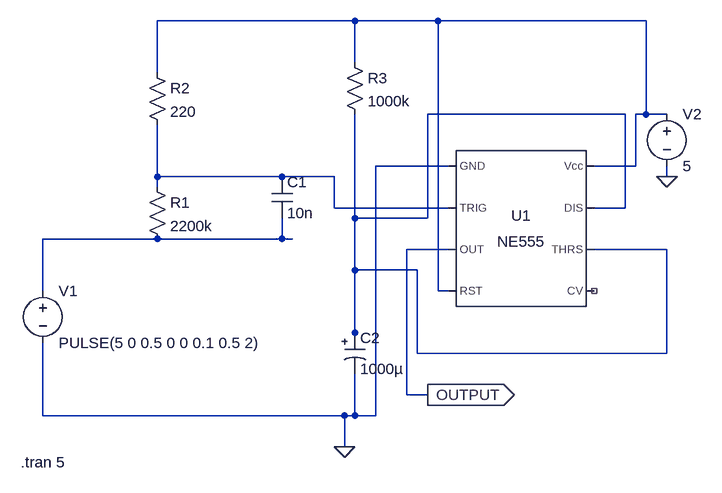
[diagram p0: schematic Erweiterte Ne555 Schaltung.asc]
Erweiterte Ne555 Schaltung.asc, the LTspice schematic file:
Version 4
SHEET 1 888 680
WIRE 352 -144 48 -144
WIRE 480 -144 352 -144
WIRE 800 -144 480 -144
WIRE 352 -80 352 -144
WIRE 48 -64 48 -144
WIRE 768 0 464 0
WIRE 800 0 800 -144
WIRE 800 0 784 0
WIRE 832 0 800 0
WIRE 496 80 384 80
WIRE 784 80 784 0
WIRE 784 80 720 80
WIRE 48 96 48 16
WIRE 240 96 48 96
WIRE 320 96 240 96
WIRE 832 96 832 80
WIRE 48 112 48 96
WIRE 320 144 320 96
WIRE 496 144 320 144
WIRE 768 144 768 0
WIRE 768 144 720 144
WIRE 352 160 352 0
WIRE 464 160 464 0
WIRE 464 160 352 160
WIRE 48 192 -128 192
WIRE 240 192 240 160
WIRE 240 192 48 192
WIRE 256 192 240 192
WIRE 496 208 432 208
WIRE 832 208 720 208
WIRE 352 240 352 160
WIRE 448 240 352 240
WIRE -128 272 -128 192
WIRE 480 272 480 -144
WIRE 496 272 480 272
WIRE 352 336 352 240
WIRE 352 352 352 336
WIRE 448 368 448 240
WIRE 832 368 832 208
WIRE 832 368 448 368
WIRE 432 432 432 208
WIRE 464 432 432 432
WIRE -128 464 -128 352
WIRE 336 464 -128 464
WIRE 352 464 352 400
WIRE 352 464 336 464
WIRE 384 464 384 80
WIRE 384 464 352 464
WIRE 336 512 336 464
FLAG 464 432 OUTPUT
IOPIN 464 432 Out
FLAG 832 96 0
FLAG 336 512 0
SYMBOL res 32 96 R0
SYMATTR InstName R1
SYMATTR Value 2200k
SYMBOL cap 224 96 R0
SYMATTR InstName C1
SYMATTR Value 10n
SYMBOL res 32 -80 R0
SYMATTR InstName R2
SYMATTR Value 220
SYMBOL res 336 -96 R0
SYMATTR InstName R3
SYMATTR Value 1000k
SYMBOL polcap 336 336 R0
SYMATTR InstName C2
SYMATTR Value 1000µ
SYMBOL voltage -128 256 R0
WINDOW 123 0 0 Left 0
WINDOW 39 0 0 Left 0
SYMATTR InstName V1
SYMATTR Value PULSE(5 0 0.5 0 0 0.1 0.5 2)
SYMBOL voltage 832 -16 R0
WINDOW 123 0 0 Left 0
WINDOW 39 0 0 Left 0
SYMATTR InstName V2
SYMATTR Value 5
SYMBOL Misc\\NE555 608 176 R0
SYMATTR InstName U1
TEXT -162 536 Left 2 !.tran 5

The netlist it stands for:
* Erweiterte Ne555 Schaltung.asc
R1 N003 N004 2200k
C1 N003 N004 10n
R2 N001 N003 220
R3 N001 N002 1000k
C2 N002 0 1000µ
V1 N004 0 PULSE(5 0 0.5 0 0 0.1 0.5 2)
V2 N001 0 5
XU1 0 N003 OUTPUT N001 NC_01 N002 N002 N001 NE555  ; pins GND TRIG OUT RST CV THRS DIS Vcc
.tran 5
.lib NE555.sub
.backanno
.end